# EAGLE design Pi2Display (EAGLE 6.5.0)
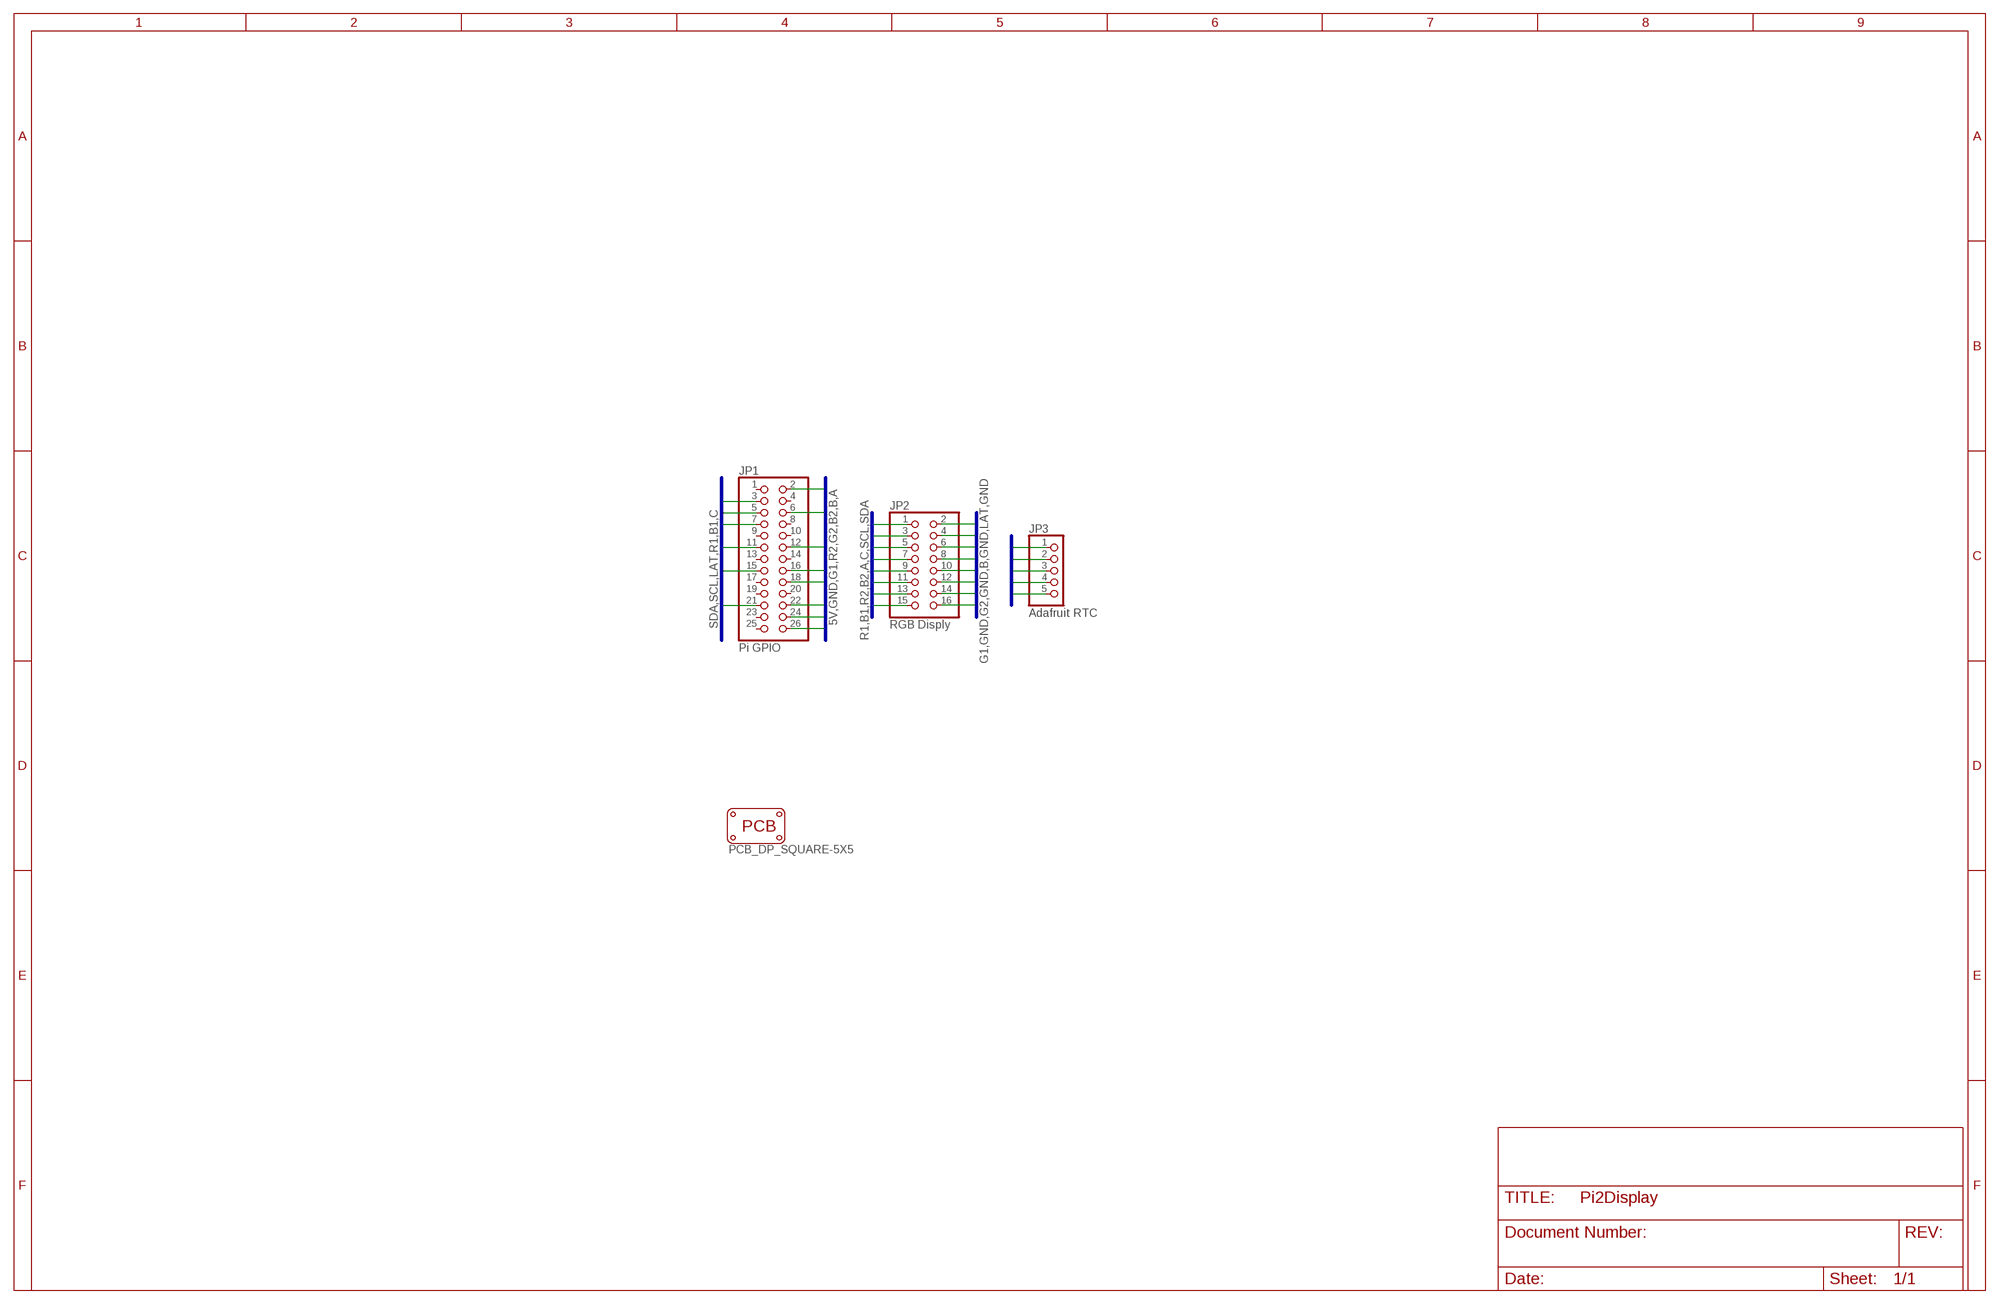
[diagram p0: schematic, sheet 1]

## Parts
JP1  Pi GPIO  PINHD-2X13  [2X13]
JP2  RGB Disply  PINHD-2X8  [2X08]
JP3  Adafruit RTC  PINHD-1X5  [1X05]
PCB1  PCB_DP_SQUARE-5X5  [DP5050_V1]

## Nets
5V: JP1.2 JP3.2
A: JP1.26 JP2.9
B: JP1.24 JP2.10
B1: JP1.15 JP2.3
B2: JP1.22 JP2.7
C: JP1.21 JP2.11
G1: JP1.12 JP2.2
G2: JP1.18 JP2.6
GND: JP1.6 JP2.4 JP2.8 JP2.12 JP2.16 JP3.1
LAT: JP1.7 JP2.14
R1: JP1.11 JP2.1
R2: JP1.16 JP2.5
SCL: JP1.5 JP2.13 JP3.4
SDA: JP1.3 JP2.15 JP3.3
SQW: JP3.5
Unconnected: JP1.1 JP1.4 JP1.8 JP1.9 JP1.10 JP1.13 JP1.14 JP1.17 JP1.19 JP1.20 JP1.23 JP1.25

## Buses
SDA,SCL,LAT,R1,B1,C
R1,B1,R2,B2,A,C,SCL,SDA
G1,GND,G2,GND,B,GND,LAT,GND
GND,5V,SDA,SCL,SQW
5V,GND,G1,R2,G2,B2,B,A

## Library data of the parts
JP1 = pinhead:PINHD-2X13: PIN HEADER
JP2 = pinhead:PINHD-2X8: PIN HEADER
JP3 = pinhead:PINHD-1X5: PIN HEADER
PCB1 = dp_pcb:PCB_DP_SQUARE: Dangerous Prototypes Standard Square PCB sizes

## Board
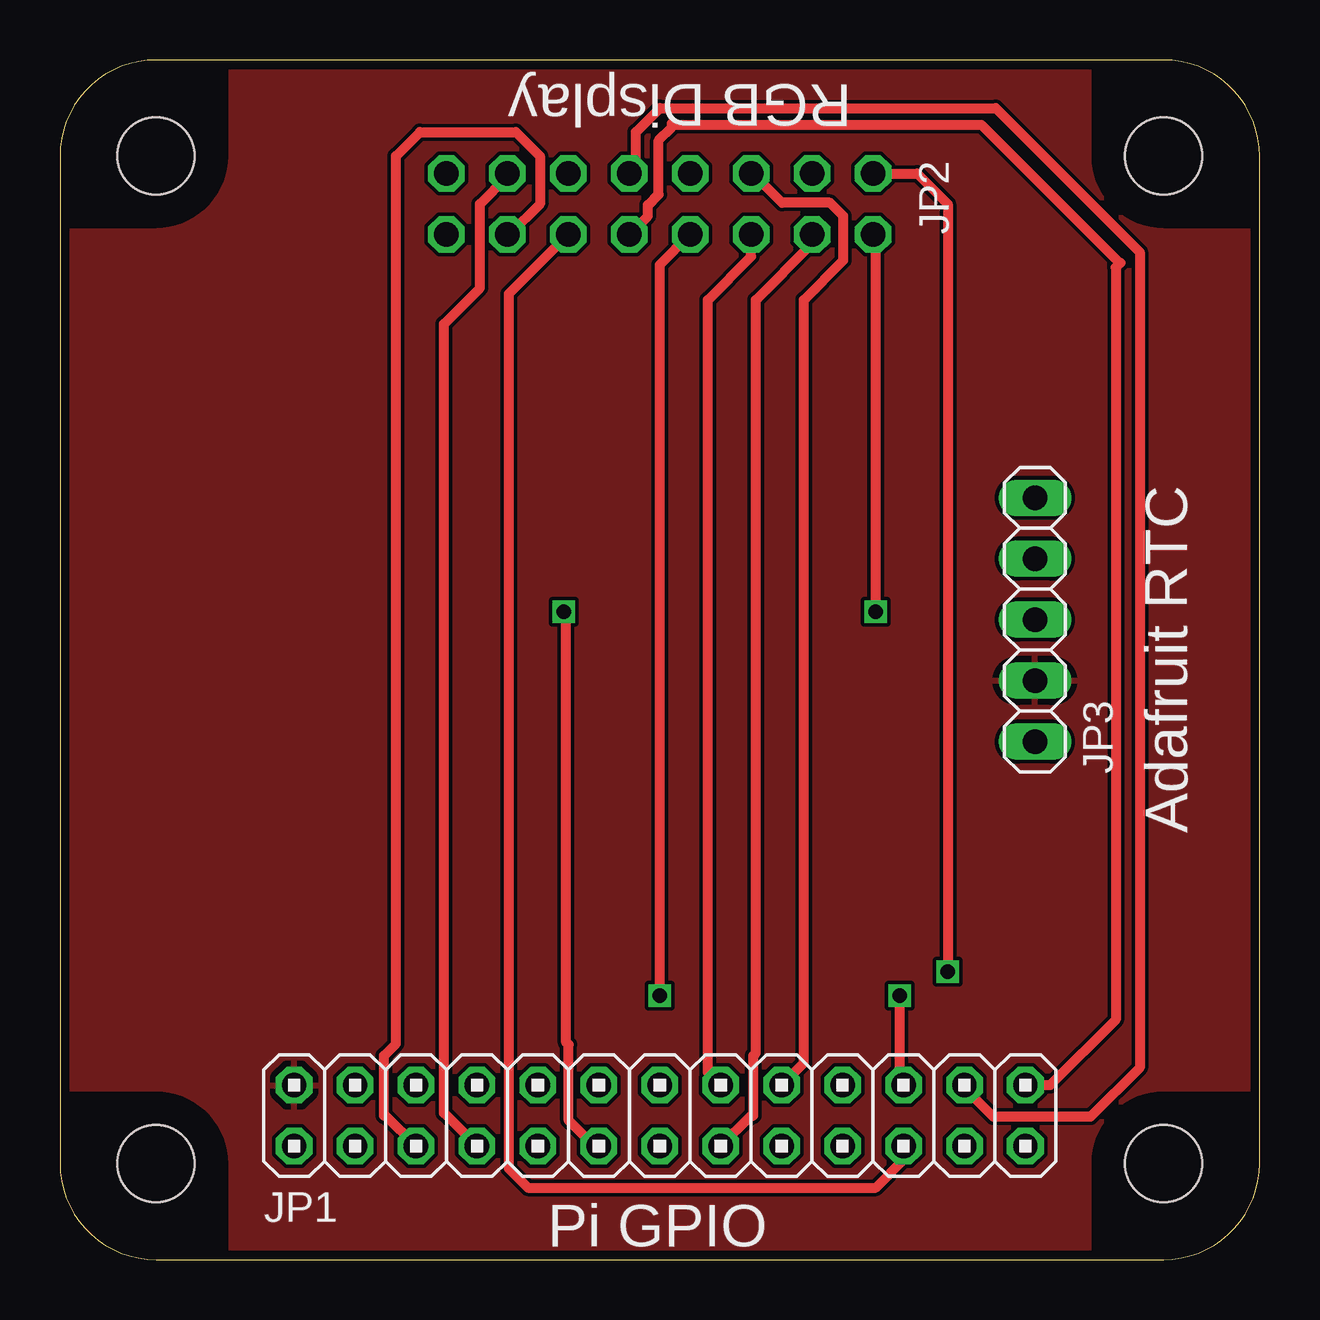
[diagram p1: board, top side]
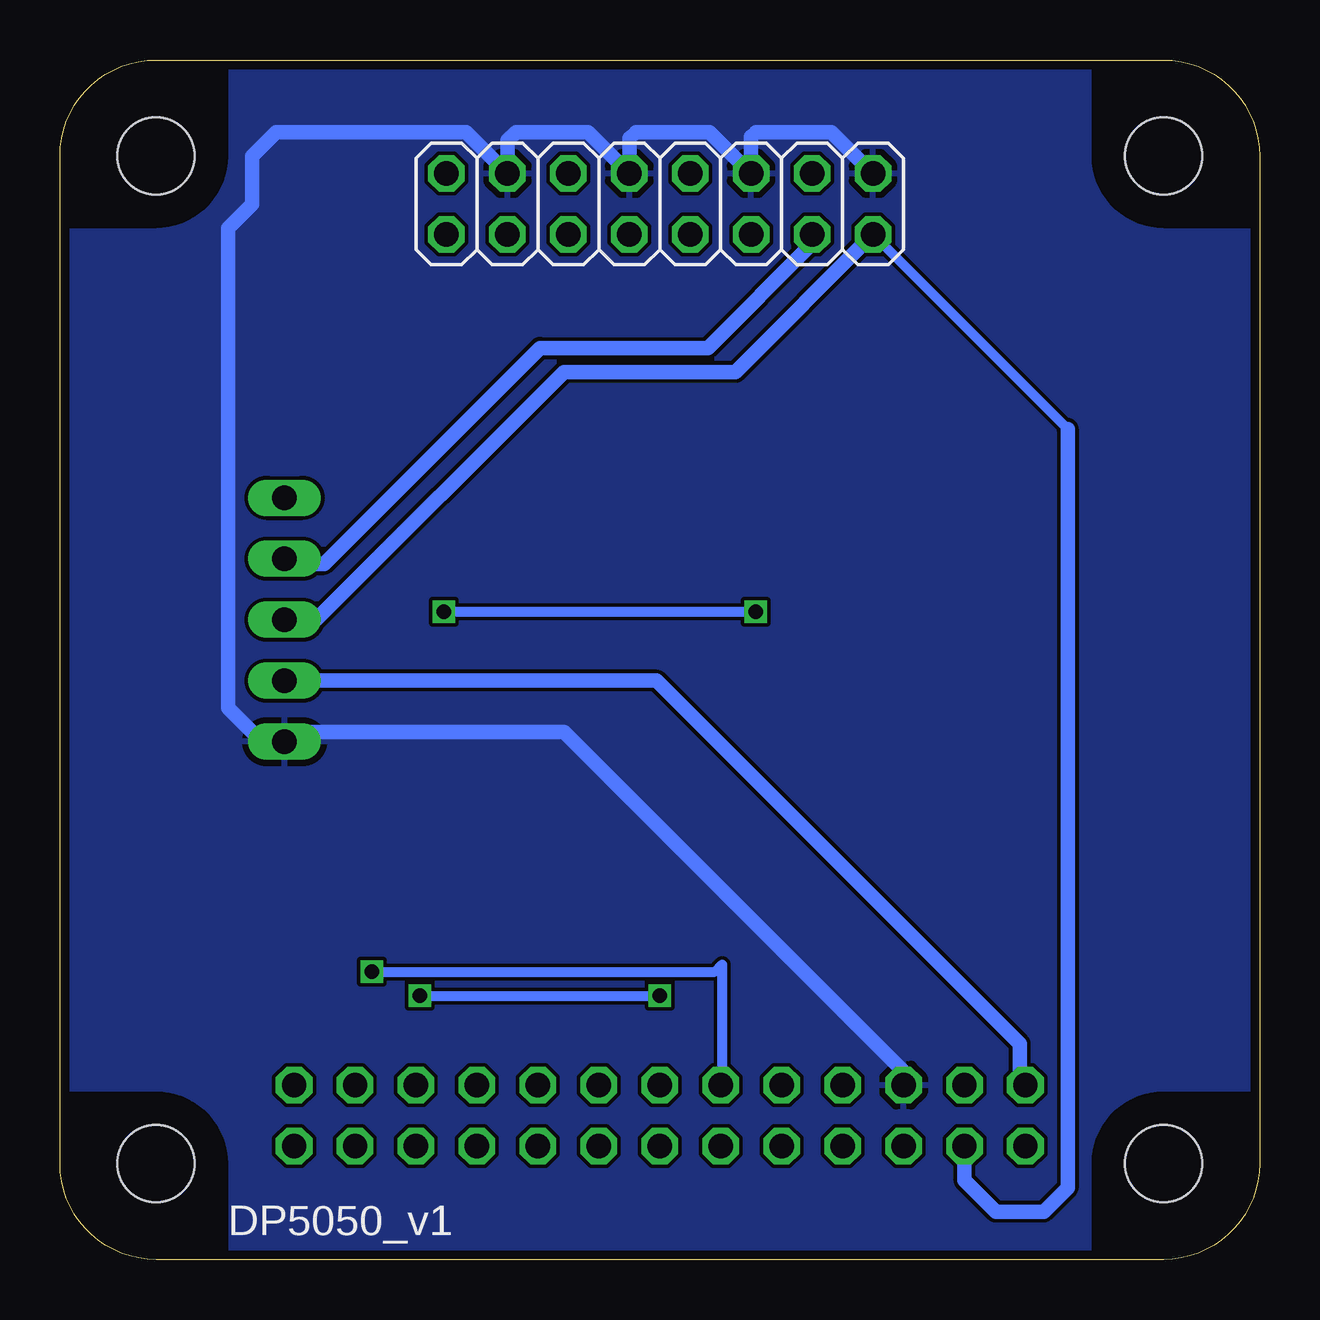
[diagram p2: board, bottom side, seen from below]

Size 50 x 50 mm. Coordinates in mm from the lower left corner, seen from the top.
Copper layers (1*16): Top 0.0356mm / dielectric 1.5011mm / Bottom 0.0356mm
Design rules "LaenPCBOrder *": minimum track width 18mil, minimum drill 13mil, track to track 6mil, track to pad 6mil, pad to pad 6mil, via to via 6mil, smd to smd 6mil, copper to edge 15mil, drill to drill 6mil, minimum pad ring 7mil, minimum via ring 7mil, stop-mask expansion 4mil, vias tented up to drill 0mil, thermal gap 10mil

### Footprints (pad centres in the part's own frame; a part is rotated, then mirrored left to right if it is on the bottom)
2X13 = drill 1.016 octagon: 1 -15.24,-1.27; 2 -15.24,1.27; 3 -12.7,-1.27; 4 -12.7,1.27; 5 -10.16,-1.27; 6 -10.16,1.27; 7 -7.62,-1.27; 8 -7.62,1.27; 9 -5.08,-1.27; 10 -5.08,1.27; 11 -2.54,-1.27; 12 -2.54,1.27; 13 0,-1.27; 14 0,1.27; 15 2.54,-1.27; 16 2.54,1.27; 17 5.08,-1.27; 18 5.08,1.27; 19 7.62,-1.27; 20 7.62,1.27; 21 10.16,-1.27; 22 10.16,1.27; 23 12.7,-1.27; 24 12.7,1.27; 25 15.24,-1.27; 26 15.24,1.27
2X08 = drill 1.016 octagon: 1 -8.89,-1.27; 2 -8.89,1.27; 3 -6.35,-1.27; 4 -6.35,1.27; 5 -3.81,-1.27; 6 -3.81,1.27; 7 -1.27,-1.27; 8 -1.27,1.27; 9 1.27,-1.27; 10 1.27,1.27; 11 3.81,-1.27; 12 3.81,1.27; 13 6.35,-1.27; 14 6.35,1.27; 15 8.89,-1.27; 16 8.89,1.27
1X05 = drill 1.016 long: 1 -5.08,0; 2 -2.54,0; 3 0,0; 4 2.54,0; 5 5.08,0
DP5050_V1 = hole 3.2: 4,4; 46,4; 46,46; 4,46

### Placement (x,y rotation side)
JP1  25,6 0 top
JP2  25,44 0 bottom
JP3  40.64,26.67 90 top
PCB1  0,0 0 top

### Tracks (layer width: path | path; a pad name or v marks a point on that pad's centre or on a via)
5V
  Bottom 0.61: JP1.2 10,7.51 10,9 25.13,24.13 JP3.2
  pour Top: 46,50 arc-90 50,46
  pour Top: 0,4 0,46 arc-90 4,50 46,50 arc-90 50,46 50,4 arc-90 46,0 4,0 arc-90
A
  Top 0.406: JP2.9 24.5,43.5 24.5,43.95 24.95,44.4 24.95,46.65 25.5,47.2 25.5,47.35 25.55,47.3 38.4,47.3 44.15,41.55 44.2,41.55 44,41.35 44,10 41.27,7.27 JP1.26
B
  Top 0.406: JP2.10 24,45.54 24,47 25,48 39,48 45,42 45,8 42.95,5.95 38.9,5.95 37.7,7.15 JP1.24
B1
  Top 0.406: JP1.15 28.81,6 28.9,6 28.9,8.5 29,8.6 29,40 31.35,42.35 JP2.3
B2  (via drill 0.6)
  Top 0.406: JP1.22 35,7.27 v35,11 | v25,11 25,41.46 JP2.7
  Bottom 0.406: v35,11 v25,11
C
  Top 0.406: JP2.11 18.7,40.24 18.7,3.8 19.5,3 34,3 35.16,4.16 JP1.21
G1  (via drill 0.6)
  Top 0.406: JP2.2 35.73,45.27 37,44 v37,12
  Bottom 0.406: v37,12 22.7,12 22.4,12.3 22.4,7.33 JP1.12
G2
  Top 0.406: JP1.18 31,8.19 31,40 32.65,41.65 32.65,43.5 32.1,44.05 30.1,44.05 28.88,45.27 JP2.6
GND
  Bottom 0.61: JP2.16 17.84,47 21,47 21.19,46.81 JP2.12 22.92,47 26,47 26.27,46.73 JP2.8 28,47 31,47 31.35,46.65 JP2.4 33.08,47 41,47 42,46 42,44 43,43 43,23 41.59,21.59 JP3.1 40.23,22 29,22 14.84,7.84 JP1.6
  pour Bottom: 46,50 arc-90 50,46 50,4 arc-90 46,0
  pour Bottom: 0,5 0,46 arc-90 4,50 46,50 arc-90 50,46 50,4 arc-90 46,0 4,0 arc-90 0,4
LAT
  Top 0.406: JP1.7 16,6.11 16,39 17.5,40.5 17.5,44 18.65,45.15 JP2.14
R1  (via drill 0.6)
  Top 0.406: JP1.11 22.27,4.73 21.2,5.8 21.2,8.95 21.1,9.05 21.1,26.9 v21,27 | v34,27 34,42.62 JP2.1
  Bottom 0.406: v21,27 v34,27
R2
  Top 0.406: JP1.16 27,7.81 27,40 28.81,41.81 JP2.5
SCL
  Top 0.406: JP1.5 13.57,6 13.5,6 13.5,8.5 14,9 14,46 15,47 19,47 20,46 20,44 18.73,42.73 JP2.13
  Bottom 0.61: JP3.4 40.43,29 39,29 30,38 23,38 18.65,42.35 JP2.13
SDA
  Bottom 0.406: 8,34.62 JP2.15
  Bottom 0.61: 8,34.62 8,3 9,2 11,2 12.3,3.3 JP1.3 | JP2.15 21.84,37 29,37 39.33,26.67 JP3.3

### Text on the board
tNames: RGB Display | Adafruit RTC | Pi GPIO